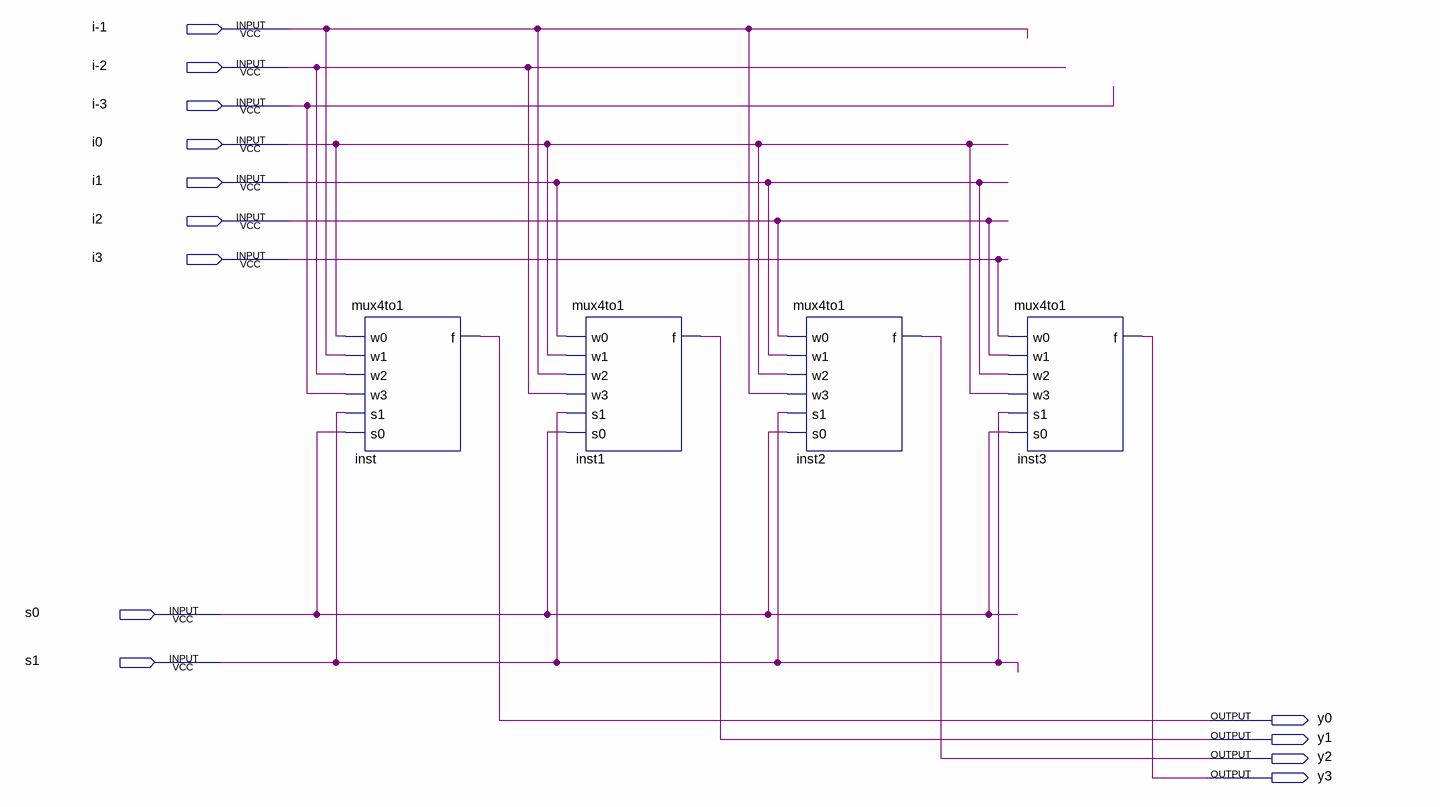
[diagram p0: schematic sheet]
// Quartus schematic lab8step2.bdf as structural Verilog: 4 symbols, 13 pins
module lab8step2 (
  input  \i-1 ,
  input  \i-2 ,
  input  \i-3 ,
  input  i0,
  input  i1,
  input  i2,
  input  i3,
  input  s0,
  input  s1,
  output y0,
  output y1,
  output y2,
  output y3
);

  mux4to1 inst (.w0(i0), .w1(\i-1 ), .w2(\i-2 ), .w3(\i-3 ), .s1(s1), .s0(s0), .f(y0));
  mux4to1 inst1 (.w0(i1), .w1(i0), .w2(\i-1 ), .w3(\i-2 ), .s1(s1), .s0(s0), .f(y1));
  mux4to1 inst2 (.w0(i2), .w1(i1), .w2(i0), .w3(\i-1 ), .s1(s1), .s0(s0), .f(y2));
  mux4to1 inst3 (.w0(i3), .w1(i2), .w2(i1), .w3(i0), .s1(s1), .s0(s0), .f(y3));
endmodule
